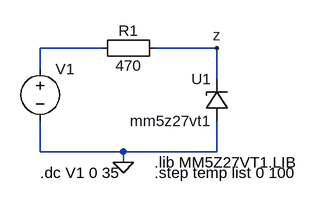
[diagram p0: schematic zener_va_Xv.asc]
zener_va_Xv.asc, the LTspice schematic file:
Version 4
SHEET 1 880 680
WIRE 112 -256 16 -256
WIRE 288 -256 192 -256
WIRE 16 -224 16 -256
WIRE 288 -208 288 -256
WIRE 16 -96 16 -144
WIRE 144 -96 16 -96
WIRE 288 -96 288 -144
WIRE 288 -96 144 -96
WIRE 144 -80 144 -96
FLAG 144 -80 0
FLAG 288 -256 z
SYMBOL Misc\\EuropeanResistor 208 -272 R90
WINDOW 0 5 56 VBottom 2
WINDOW 3 27 56 VTop 2
SYMATTR InstName R1
SYMATTR Value 470
SYMBOL zener-macro-model 304 -144 R180
WINDOW 0 24 64 Left 2
WINDOW 3 24 0 Left 2
SYMATTR InstName U1
SYMATTR Value mm5z27vt1
SYMBOL voltage 16 -240 R0
SYMATTR InstName V1
SYMATTR Value ""
TEXT 16 -64 Left 2 !.dc V1 0 35
TEXT 192 -64 Left 2 !.step temp list 0 100
TEXT 192 -80 Left 2 !.lib MM5Z27VT1.LIB

The netlist it stands for:
* zener_va_Xv.asc
R1 z N001 470
XU1 0 z mm5z27vt1  ; pins + -
V1 N001 0
.dc V1 0 35
.step temp list 0 100
.lib MM5Z27VT1.LIB
.backanno
.end